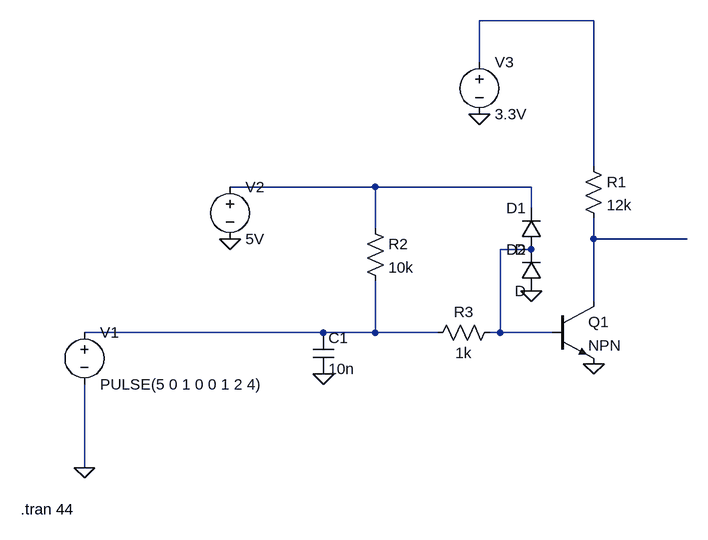
[diagram p0: schematic P1-smart-meter.asc]
P1-smart-meter.asc, the LTspice schematic file:
Version 4
SHEET 1 880 680
WIRE -1968 -1840 -2144 -1840
WIRE -2144 -1776 -2144 -1840
WIRE -1968 -1616 -1968 -1840
WIRE -2304 -1584 -2528 -1584
WIRE -2064 -1584 -2304 -1584
WIRE -2064 -1552 -2064 -1584
WIRE -2304 -1520 -2304 -1584
WIRE -1968 -1504 -1968 -1536
WIRE -1824 -1504 -1968 -1504
WIRE -2064 -1488 -2112 -1488
WIRE -1968 -1408 -1968 -1504
WIRE -2384 -1360 -2752 -1360
WIRE -2304 -1360 -2304 -1440
WIRE -2304 -1360 -2384 -1360
WIRE -2208 -1360 -2304 -1360
WIRE -2112 -1360 -2112 -1488
WIRE -2112 -1360 -2128 -1360
WIRE -2032 -1360 -2112 -1360
WIRE -2752 -1152 -2752 -1280
FLAG -2752 -1152 0
FLAG -2528 -1504 0
FLAG -2144 -1696 0
FLAG -2064 -1424 0
FLAG -2384 -1296 0
FLAG -1968 -1312 0
SYMBOL voltage -2752 -1376 R0
WINDOW 123 0 0 Left 0
WINDOW 39 0 0 Left 0
SYMATTR InstName V1
SYMATTR Value PULSE(5 0 1 0 0 1 2 4)
SYMBOL res -1984 -1632 R0
SYMATTR InstName R1
SYMATTR Value 12k
SYMBOL res -2320 -1536 R0
SYMATTR InstName R2
SYMATTR Value 10k
SYMBOL voltage -2528 -1600 R0
WINDOW 123 0 0 Left 0
WINDOW 39 0 0 Left 0
SYMATTR InstName V2
SYMATTR Value 5V
SYMBOL res -2112 -1376 R90
WINDOW 0 0 56 VBottom 2
WINDOW 3 32 56 VTop 2
SYMATTR InstName R3
SYMATTR Value 1k
SYMBOL npn -2032 -1408 R0
SYMATTR InstName Q1
SYMBOL voltage -2144 -1792 R0
WINDOW 123 0 0 Left 0
WINDOW 39 0 0 Left 0
SYMATTR InstName V3
SYMATTR Value 3.3V
SYMBOL diode -2048 -1488 R180
WINDOW 0 24 64 Left 2
WINDOW 3 24 0 Left 2
SYMATTR InstName D1
SYMBOL diode -2048 -1424 R180
WINDOW 0 24 64 Left 2
WINDOW 3 24 0 Left 2
SYMATTR InstName D2
SYMBOL cap -2400 -1360 R0
SYMATTR InstName C1
SYMATTR Value 10n
TEXT -2850 -1088 Left 2 !.tran 44

The netlist it stands for:
* P1-smart-meter.asc
V1 N005 0 PULSE(5 0 1 0 0 1 2 4)
R1 N001 N003 12k
R2 N002 N005 10k
V2 N002 0 5V
R3 N004 N005 1k
Q1 N003 N004 0 0 NPN
V3 N001 0 3.3V
D1 N004 N002 D
D2 0 N004 D
C1 N005 0 10n
.model D D
.lib standard.dio
.model NPN NPN
.model PNP PNP
.lib standard.bjt
.tran 44
.backanno
.end